# Altium schematic sheet Sheet1_testes.SchDoc
size A4; SheetNumber: 1; SheetTotal: 1
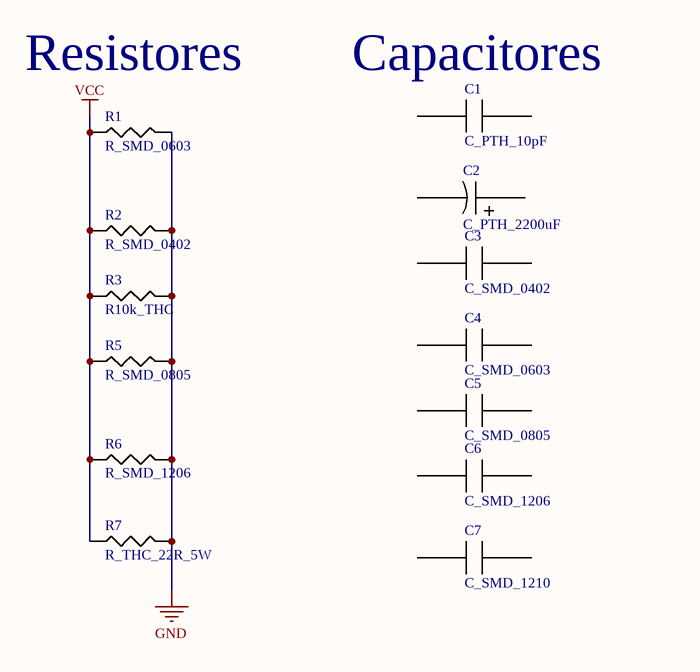
[diagram p0: Sheet1_testes.SchDoc]

## Parts
C1  C_PTH_10pF  [C_PTH_10pF]
C2  C_PTH_2200uF  [C_PTH_2200uF]
C3  C_SMD_0402  [C_SMD_0402]
C4  C_SMD_0603  [C_SMD_0603]
C5  C_SMD_0805  [C_SMD_0805]
C6  C_SMD_1206  [C_SMD_1206]
C7  C_SMD_1210  [C_SMD_1210]
R1  R_SMD_0603  [R_SMD_0603]
R2  R_SMD_0402  [R_SMD_0402]
R3  R10k_THC  [R_THC_10k]
R5  R_SMD_0805  [R_SMD_0805]
R6  R_SMD_1206  [R_SMD_1206]
R7  R_THC_22R_5W  [R_THC_22R_5W]

## Nets
GND: R1.2 R2.2 R3.2 R5.2 R6.2 R7.2
VCC: R1.1 R2.1 R3.1 R5.1 R6.1 R7.1

Not connected (* = marked no-connect by the designer): C1 1 2; C2 1 2; C3 1 2; C4 1 2; C5 1 2; C6 1 2; C7 1 2

## Notes on the sheet
- (near R1) Resistores
- (near C1) Capacitores

## Library data of the parts
R3 = R10k_THC: Supplier 1: Digikey; Supplier Part Number 1: RNF14FTD10K0CT-ND